# EAGLE design M502X (EAGLE 6.6.0)
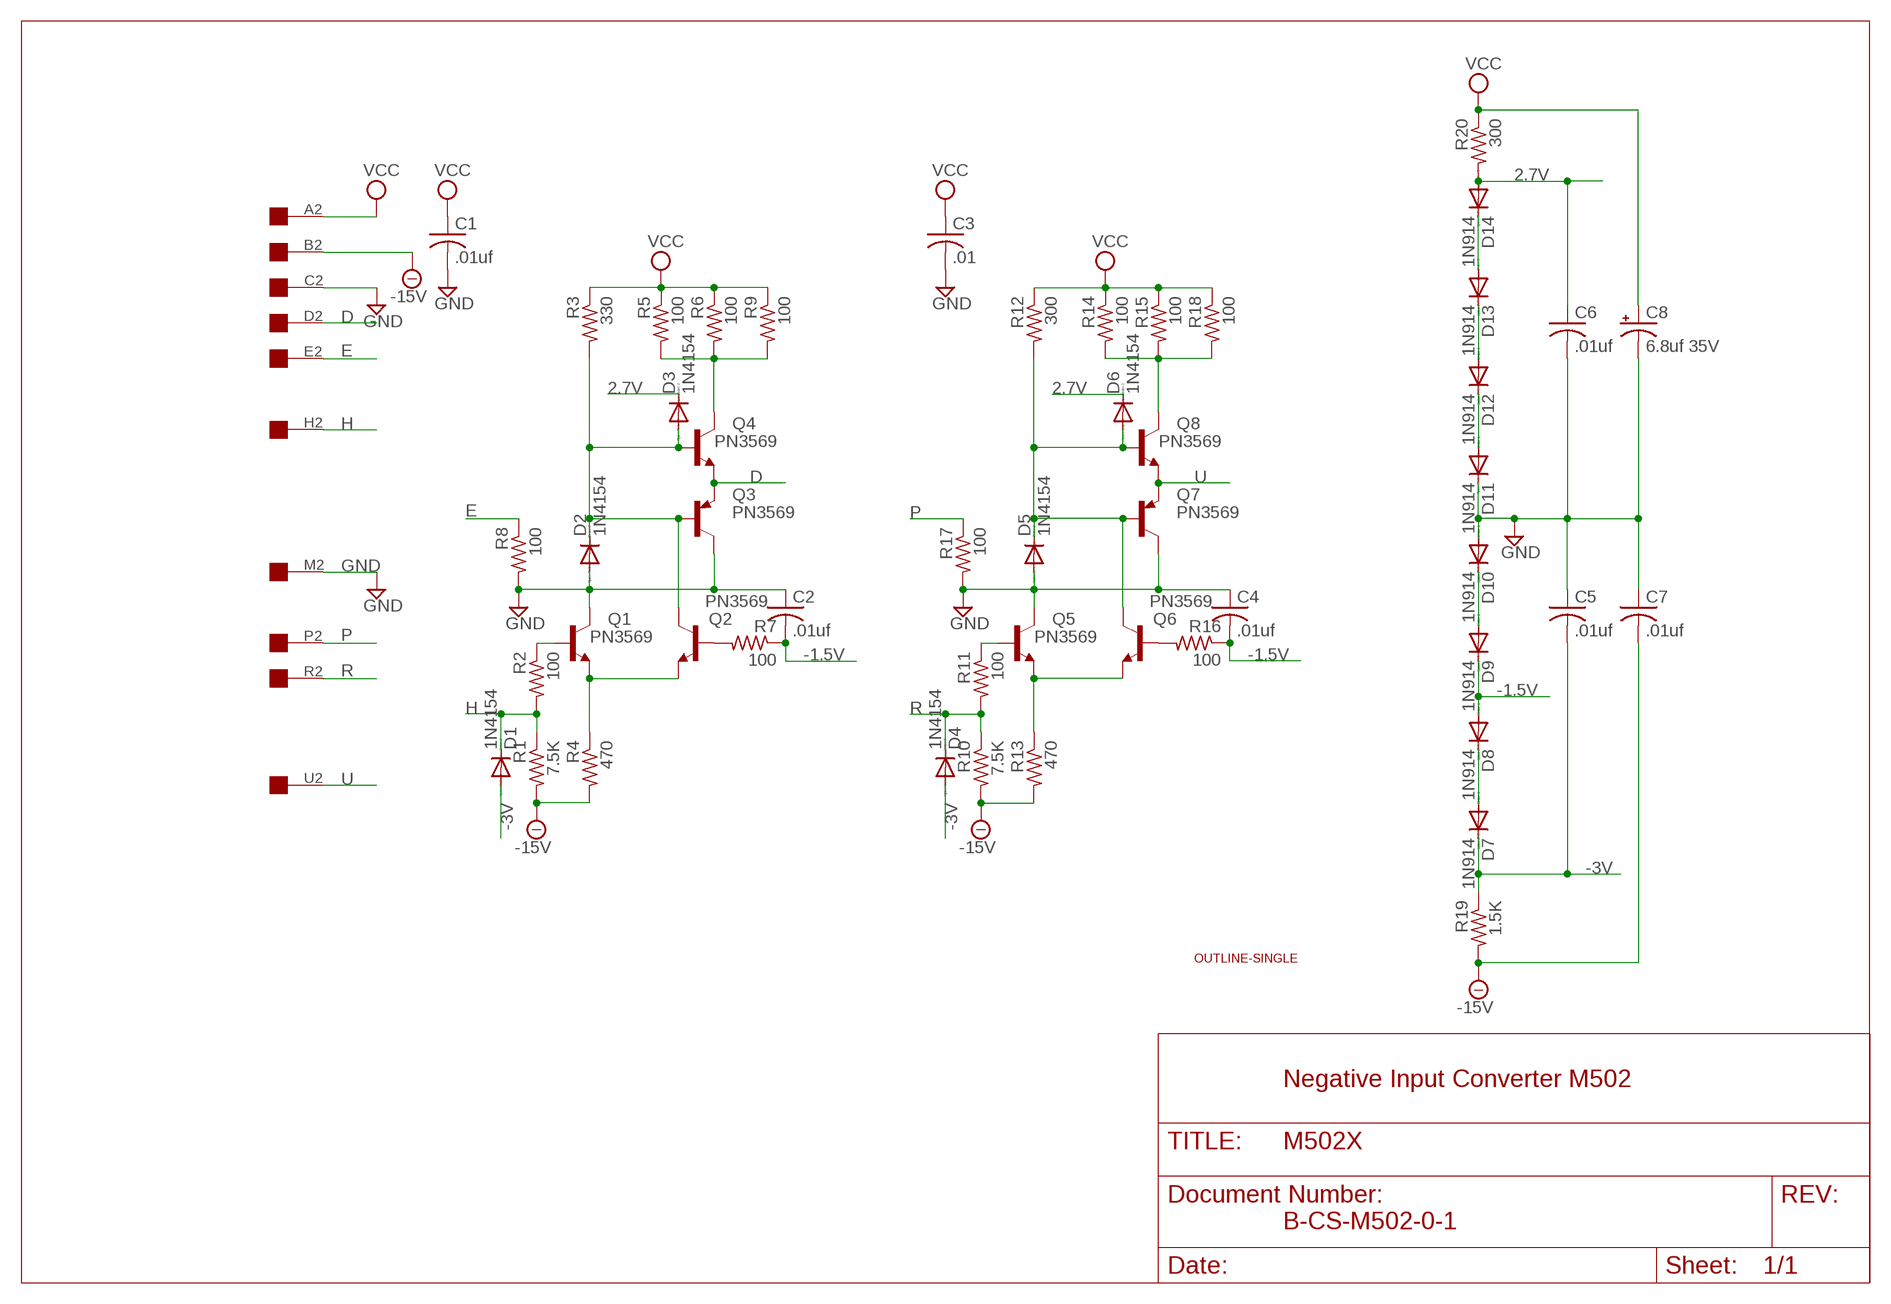
[diagram p0: schematic, sheet 1]

## Parts
C1  .01uf  C-US050-025X075  [C050-025X075]
C2  .01uf  C-US050-025X075  [C050-025X075]
C3  .01  C-US050-025X075  [C050-025X075]
C4  .01uf  C-US050-025X075  [C050-025X075]
C5  .01uf  C-US050-025X075  [C050-025X075]
C6  .01uf  C-US050-025X075  [C050-025X075]
C7  .01uf  C-US050-025X075  [C050-025X075]
C8  6.8uf 35V  CPOL-USE15-5AXIAL  [E15-5]
D1  1N4154  1N4004  [DO41-10]
D2  1N4154  1N4004  [DO41-10]
D3  1N4154  1N4004  [DO41-10]
D4  1N4154  1N4004  [DO41-10]
D5  1N4154  1N4004  [DO41-10]
D6  1N4154  1N4004  [DO41-10]
D7  1N914  1N4004  [DO41-10]
D8  1N914  1N4004  [DO41-10]
D9  1N914  1N4004  [DO41-10]
D10  1N914  1N4004  [DO41-10]
D11  1N914  1N4004  [DO41-10]
D12  1N914  1N4004  [DO41-10]
D13  1N914  1N4004  [DO41-10]
D14  1N914  1N4004  [DO41-10]
Q1  PN3569  2N1711  [TO39]
Q2  PN3569  2N1711  [TO39]
Q3  PN3569  2N5415  [TO39]
Q4  PN3569  2N1711  [TO39]
Q5  PN3569  2N1711  [TO39]
Q6  PN3569  2N1711  [TO39]
Q7  PN3569  2N5415  [TO39]
Q8  PN3569  2N1711  [TO39]
R1  7.5K  R-US_0207/10  [0207/10]
R2  100  R-US_0207/10  [0207/10]
R3  330  R-US_0207/10  [0207/10]
R4  470  R-US_0207/10  [0207/10]
R5  100  R-US_0207/10  [0207/10]
R6  100  R-US_0207/10  [0207/10]
R7  100  R-US_0207/10  [0207/10]
R8  100  R-US_0207/10  [0207/10]
R9  100  R-US_0207/10  [0207/10]
R10  7.5K  R-US_0207/10  [0207/10]
R11  100  R-US_0207/10  [0207/10]
R12  300  R-US_0207/10  [0207/10]
R13  470  R-US_0207/10  [0207/10]
R14  100  R-US_0207/10  [0207/10]
R15  100  R-US_0207/10  [0207/10]
R16  100  R-US_0207/10  [0207/10]
R17  100  R-US_0207/10  [0207/10]
R18  100  R-US_0207/10  [0207/10]
R19  1.5K  R-US_0207/10  [0207/10]
R20  300  R-US_0207/10  [0207/10]
U$1  EDGE-1  [EDGE-CON1]
U$2  OUTLINE-SINGLE  [SINGLE]

## Nets
2.7V: C6.1 D3.C D6.C D14.A R20.2
-1.5V: C2.2 C4.2 D8.A D9.C R7.1 R16.1
-3V: C5.2 D1.A D4.A D7.C R19.1
-15V: C7.2 R1.2 R4.2 R10.2 R13.2 R19.2 U$1.B2
D: Q3.1(E) Q4.1(E) U$1.D2
E: R8.1 U$1.E2
GND: C1.2 C2.1 C3.2 C4.1 C5.1 C6.2 C7.1 C8.- D2.A D5.A D10.A D11.C Q1.3(C) Q3.3(C) Q5.3(C) Q7.3(C) R8.2 R17.2 U$1.C2 U$1.M2
H: D1.C R1.1 R2.2 U$1.H2
N$1: Q4.3(C) R5.2 R6.2 R9.2
N$2: Q1.2(B) R2.1
N$3: Q5.1(E) Q6.1(E) R13.1
N$4: Q1.1(E) Q2.1(E) R4.1
N$6: D11.A D12.C
N$7: D2.C D3.A Q2.3(C) Q3.2(B) Q4.2(B) R3.2
N$9: D7.A D8.C
N$10: Q5.2(B) R11.1
N$11: D5.C D6.A Q6.3(C) Q7.2(B) Q8.2(B) R12.2
N$12: Q2.2(B) R7.2
N$13: D12.A D13.C
N$14: D9.A D10.C
N$15: Q8.3(C) R14.2 R15.2 R18.2
N$17: D13.A D14.C
N$19: Q6.2(B) R16.2
P: R17.1 U$1.P2
R: D4.C R10.1 R11.2 U$1.R2
U: Q7.1(E) Q8.1(E) U$1.U2
VCC: C1.1 C3.1 C8.+ R3.1 R5.1 R6.1 R9.1 R12.1 R14.1 R15.1 R18.1 R20.1 U$1.A2
Unconnected: U$1.F2 U$1.J2 U$1.K2 U$1.L2 U$1.N2 U$1.S2 U$1.T2 U$1.V2

## Notes on the sheet
- Negative Input Converter M502
- B-CS-M502-0-1

## Library data of the parts
C1-C7 = rcl:C-US: CAPACITOR, American symbol
C8 = rcl:CPOL-US: POLARIZED CAPACITOR, American symbol
D1-D14 = diode:1N4004: DIODE general purpose rectifier, 1 A
Q1 Q2 Q4-Q6 Q8 = transistor-npn:2N1711: NPN Transistor
Q3 Q7 = transistor-pnp:2N5415*: PNP Transistror
R1-R20 = rcl:R-US_: RESISTOR, American symbol
U$1 = dec-con:EDGE-1: Single-Sided DEC Edge Connector -- (side 2)
U$2 = dec-con:OUTLINE-*: Board outlines for DEC boards.

## Board
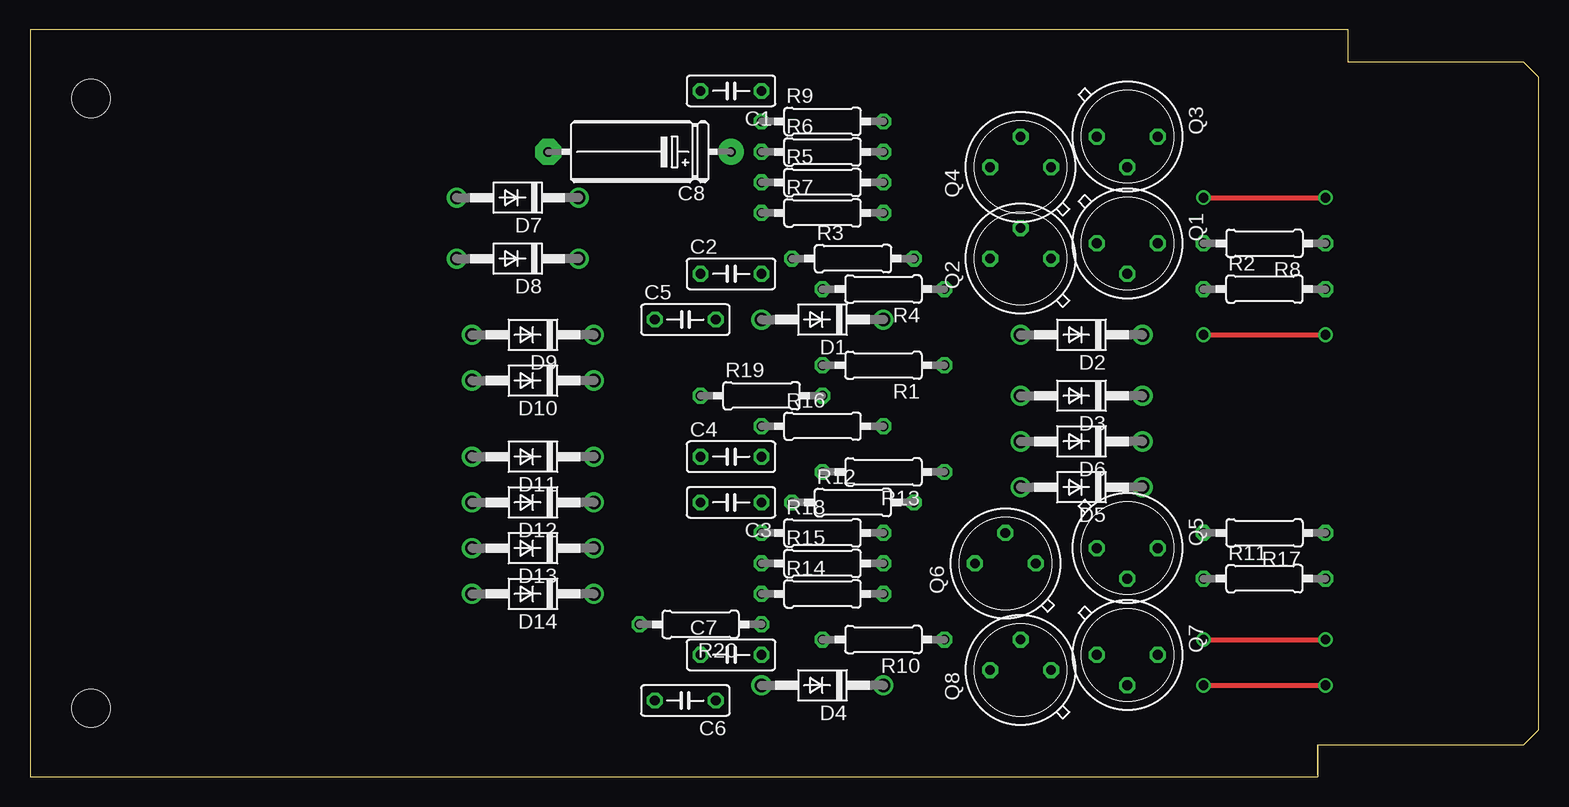
[diagram p1: board, top side]
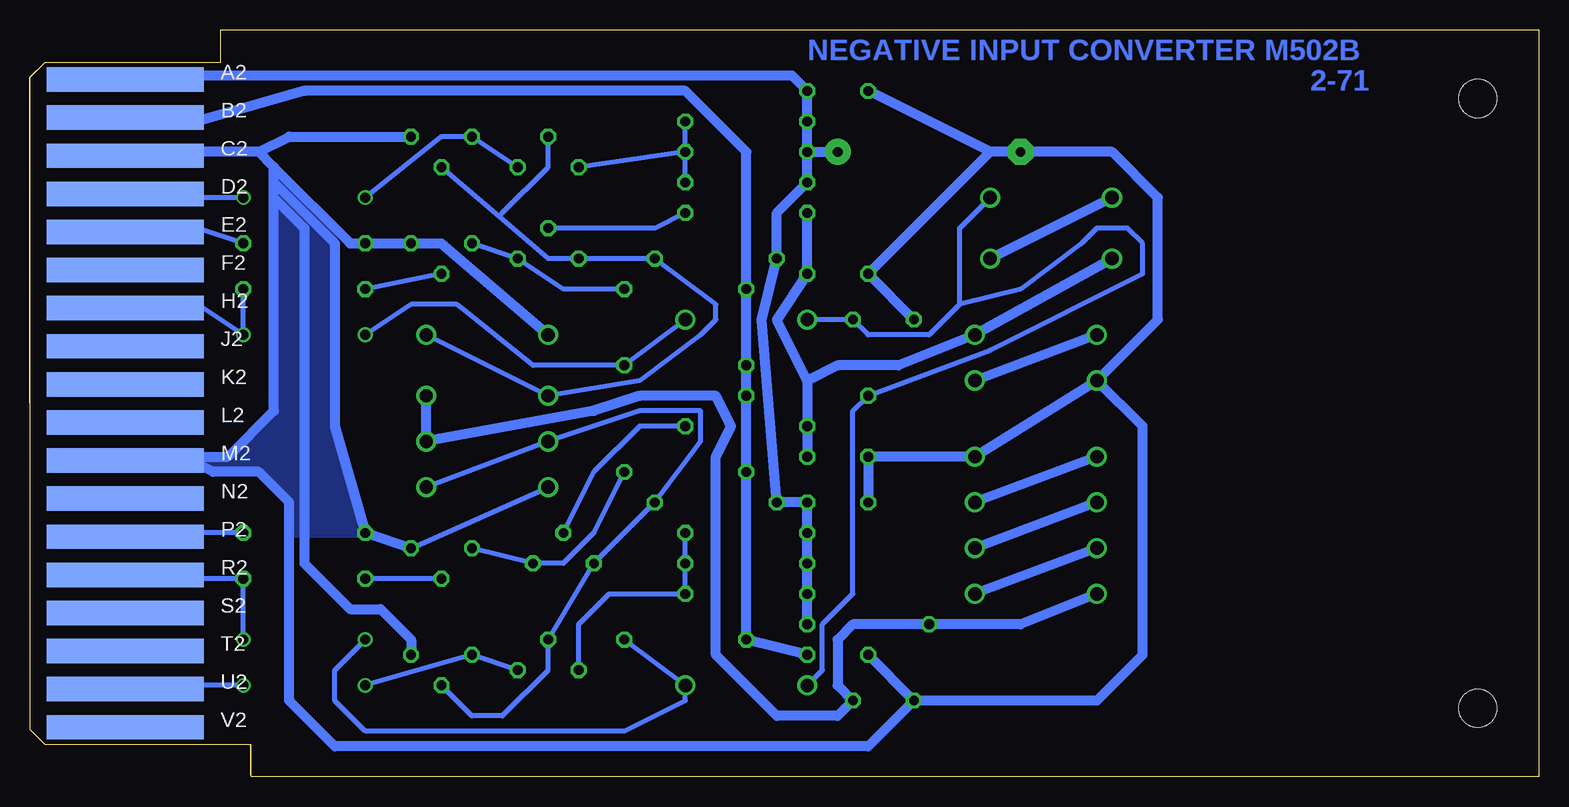
[diagram p2: board, bottom side, seen from below]

Size 125.73 x 62.23 mm. Coordinates in mm from the lower left corner, seen from the top.
Copper layers (1+16): Top 0.035mm / dielectric 1.5mm / Bottom 0.035mm
Design rules "16mils": minimum track width 16mil, minimum drill 32mil, track to track 15mil, track to pad 10mil, pad to pad 10mil, via to via 10mil, smd to smd 10mil, copper to edge 13mil, drill to drill 10mil, minimum pad ring 10mil, minimum via ring 8mil, stop-mask expansion 0mil, vias tented up to drill 0mil, thermal gap 10mil

### Footprints (pad centres in the part's own frame; a part is rotated, then mirrored left to right if it is on the bottom)
C050-025X075 = drill 0.813 octagon: 1 -2.54,0; 2 2.54,0
E15-5 = drill 0.813 pad 2.159: + -7.62,0 | drill 0.813 pad 2.159 octagon: - 7.62,0
DO41-10 = drill 1.118: A 5.08,0; C -5.08,0
TO39 = drill 0.813 octagon: 1 0,-2.54; 2 2.54,0; 3 0,2.54
0207/10 = drill 0.813 octagon: 1 -5.08,0; 2 5.08,0
EDGE-CON1 = smd 13.106 x 2.032 bottom: A2 7.938,4.128; B2 7.938,7.303; C2 7.938,10.477; D2 7.938,13.652; E2 7.938,16.828; F2 7.938,20.003; H2 7.938,23.177; J2 7.938,26.352; K2 7.938,29.527; L2 7.938,32.703; M2 7.938,35.877; N2 7.938,39.053; P2 7.938,42.227; R2 7.938,45.403; S2 7.938,48.578; T2 7.938,51.752; U2 7.938,54.928; V2 7.938,58.102
SINGLE = hole 3.175: 120.65,56.515; 120.65,5.715

### Placement (x,y rotation side)
C1  58.42,57.15 180 top
C2  58.42,41.91 0 top
C3  58.42,22.86 180 top
C4  58.42,26.67 0 top
C5  54.61,38.1 0 top
C6  54.61,6.35 180 top
C7  58.42,10.16 0 top
C8  50.8,52.07 180 top
D1  66.04,38.1 180 top
D2  87.63,36.83 180 top
D3  87.63,31.75 180 top
D4  66.04,7.62 180 top
D5  87.63,24.13 180 top
D6  87.63,27.94 180 top
D7  40.64,48.26 180 top
D8  40.64,43.18 180 top
D9  41.91,36.83 180 top
D10  41.91,33.02 180 top
D11  41.91,26.67 180 top
D12  41.91,22.86 180 top
D13  41.91,19.05 180 top
D14  41.91,15.24 180 top
Q1  91.44,44.45 270 top
Q2  82.55,43.18 90 top
Q3  91.44,53.34 270 top
Q4  82.55,50.8 90 top
Q5  91.44,19.05 270 top
Q6  81.28,17.78 90 top
Q7  91.44,10.16 270 top
Q8  82.55,8.89 90 top
R1  71.12,34.29 180 top
R2  102.87,40.64 0 top
R3  68.58,43.18 0 top
R4  71.12,40.64 180 top
R5  66.04,49.53 0 top
R6  66.04,52.07 0 top
R7  66.04,46.99 0 top
R8  102.87,44.45 180 top
R9  66.04,54.61 0 top
R10  71.12,11.43 180 top
R11  102.87,16.51 0 top
R12  68.58,22.86 0 top
R13  71.12,25.4 180 top
R14  66.04,15.24 0 top
R15  66.04,17.78 0 top
R16  66.04,29.21 0 top
R17  102.87,20.32 180 top
R18  66.04,20.32 0 top
R19  60.96,31.75 0 top
R20  55.88,12.7 180 top
U$1  125.73,62.23 180 top
U$2  125.73,62.23 180 top

### Tracks (layer width: path | path; a pad name or v marks a point on that pad's centre or on a via)
2.7V
  Bottom 0.813: D14.A 43.18,12.7 R20.2 57.15,12.7 58.42,11.43 58.42,7.62 C6.1 58.42,5.08 63.5,5.08 68.58,10.16 68.58,26.67 67.31,29.21 68.58,31.75 74.93,31.75 78.74,30.48 D6.C D3.C
-1.5V
  Bottom 0.813: R7.1 C2.2 63.5,38.1 60.96,33.02 | C4.2 R16.1 60.96,33.02 | D8.A D9.C 53.34,34.29 58.42,34.29 60.96,33.02
-3V
  Bottom 0.406: D4.A 59.69,8.89 59.69,12.7 57.15,15.24 57.15,30.48 R19.1 45.72,35.56 33.02,41.91 33.02,44.45 34.29,45.72 36.83,45.72 38.1,44.45 43.18,40.64 48.26,39.37 | D7.C 48.26,45.72 48.26,39.37 | D1.A C5.2 55.88,36.83 50.8,36.83 48.26,39.37
-15V
  Bottom 0.813: U$1.B2 117.13,54.9 116.84,54.61 111.76,54.61 102.87,57.15 71.12,57.15 66.04,52.07 R4.2 R1.2 R19.2 R13.2 R10.2 C7.2
D  (via drill 0.81)
  Top 0.406: v97.79,48.26 v107.95,48.26
  Bottom 0.406: U$1.D2 117.14,48.56 116.84,48.26 v107.95,48.26 | v97.79,48.26 91.44,53.34 Q3.1 Q4.1
E
  Bottom 0.406: U$1.E2 117.17,45.39 116.84,45.72 111.76,45.72 R8.1
GND
  Bottom 0.406: Q5.3 D5.A
  Bottom 0.813: Q3.3 104.14,53.34 106.68,52.07 | U$1.C2 117.17,51.74 116.84,52.07 106.68,52.07 | 105.41,50.8 99.06,44.45 R8.2 Q1.3 91.44,44.45 D2.A | 105.41,50.8 106.68,52.07 | U$1.M2 117.17,26.34 116.84,26.67 113.03,26.67 | 113.03,26.67 109.22,26.67 105.41,30.48 105.41,48.26 | 105.41,48.26 105.41,49.53 | 105.41,49.53 105.41,50.8 | 105.41,49.53 100.33,44.45 100.33,29.21 R17.2 Q5.3 | D10.A 33.02,29.21 33.02,10.16 36.83,6.35 C6.2 | 113.03,26.67 110.49,25.4 106.68,25.4 104.14,22.86 104.14,6.35 100.33,2.54 55.88,2.54 C6.2 | Q7.3 93.98,11.43 96.52,13.97 99.06,13.97 102.87,17.78 102.87,45.72 105.41,48.26 | C6.2 C7.1 | 45.72,52.07 C1.2 | 45.72,52.07 C8.- 35.56,52.07 31.75,48.26 31.75,38.1 D10.A | 45.72,52.07 C2.1 C5.1 | D10.A D11.C C4.1 C3.2
  pour Bottom: 105.41,50.8 100.33,44.45 100.33,29.21 97.79,20.32 104.14,20.32 104.14,21.59 104.14,22.86 106.68,25.4 110.49,25.4 113.03,26.67 109.22,26.67 105.41,30.48
H  (via drill 0.81)
  Top 0.406: v97.79,36.83 v107.95,36.83
  Bottom 0.406: U$1.H2 117.17,39.04 116.84,39.37 111.76,39.37 v107.95,36.83 R2.2 | D1.C R1.1 83.82,34.29 90.17,39.37 93.98,39.37 v97.79,36.83
N$1
  Bottom 0.406: R6.2 Q4.3 | R6.2 R9.2 | R5.2 R6.2
N$2
  Bottom 0.406: Q1.2 R2.1
N$3
  Bottom 0.406: R13.1 78.74,20.32 81.28,17.78 Q6.1 Q5.1
N$4
  Bottom 0.406: Q1.1 Q2.1 81.28,40.64 R4.1
N$6
  Bottom 0.813: D11.A D12.C
N$7
  Bottom 0.406: 86.63,46.68 82.55,43.18 Q2.3 R3.2 68.58,39.37 68.58,38.1 69.85,36.83 74.93,33.02 D3.A D2.C | 86.63,46.68 Q3.2 | Q4.2 82.55,50.8 86.36,46.99 86.63,46.68
N$9
  Bottom 0.813: D7.A D8.C
N$10
  Bottom 0.406: Q5.2 R11.1
N$11
  Bottom 0.406: Q7.2 88.9,5.08 86.36,5.08 82.55,8.89 Q8.2 Q6.3 R12.2 69.85,27.94 69.85,30.48 74.93,30.48 D6.A D5.C
N$12
  Bottom 0.406: R7.2 73.66,45.72 Q2.2
N$13
  Bottom 0.813: D12.A D13.C
N$14
  Bottom 0.813: D9.A D10.C
N$15
  Bottom 0.406: R18.2 R15.2 R14.2 77.47,15.24 80.01,12.7 Q8.3
N$17
  Bottom 0.813: D13.A D14.C
N$19
  Bottom 0.406: R16.2 74.93,29.21 78.74,25.4 Q6.2
P
  Bottom 0.406: U$1.P2 116.84,20.32 R17.1
R  (via drill 0.81)
  Top 0.406: v97.79,11.43 v107.95,11.43
  Bottom 0.406: U$1.R2 117.17,16.84 116.84,16.51 R11.2 v107.95,11.43 | R10.1 D4.C 71.12,6.35 76.2,3.81 97.79,3.81 100.33,6.35 100.33,8.89 v97.79,11.43
U  (via drill 0.81)
  Top 0.406: v97.79,7.62 v107.95,7.62
  Bottom 0.406: U$1.U2 117.2,7.26 116.84,7.62 v107.95,7.62 | Q8.1 Q7.1 v97.79,7.62
VCC
  Bottom 0.813: U$1.A2 117.22,58.04 116.84,58.42 62.23,58.42 C1.1 R9.1 R6.1 | R6.1 C8.+ | R6.1 R5.1 63.5,46.99 R3.1 64.77,38.1 R12.1 C3.1 R18.1 R15.1 R14.1 R20.1

### Text on the board
Bottom: NEGATIVE INPUT CONVERTER M502B | 2-71